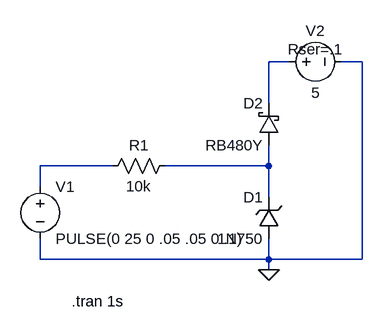
[diagram p0: schematic input_power_sim.asc]
input_power_sim.asc, the LTspice schematic file:
Version 4
SHEET 1 880 680
WIRE 304 -32 272 -32
WIRE 416 -32 384 -32
WIRE 272 32 272 -32
WIRE 32 128 -80 128
WIRE 272 128 272 96
WIRE 272 128 112 128
WIRE -80 160 -80 128
WIRE 272 176 272 128
WIRE -80 272 -80 240
WIRE 272 272 272 240
WIRE 272 272 -80 272
WIRE 416 272 416 -32
WIRE 416 272 272 272
WIRE 272 288 272 272
FLAG 272 288 0
SYMBOL zener 288 240 R180
WINDOW 0 24 64 Left 2
WINDOW 3 24 0 Left 2
SYMATTR InstName D1
SYMATTR Value 1N750
SYMBOL schottky 288 96 R180
WINDOW 0 24 64 Left 2
WINDOW 3 24 0 Left 2
SYMATTR InstName D2
SYMATTR Value RB480Y
SYMBOL res 128 112 R90
WINDOW 0 0 56 VBottom 2
WINDOW 3 32 56 VTop 2
SYMATTR InstName R1
SYMATTR Value 10k
SYMBOL voltage -80 144 R0
WINDOW 123 0 0 Left 2
WINDOW 39 0 0 Left 2
SYMATTR InstName V1
SYMATTR Value PULSE(0 25 0 .05 .05 0 .1)
SYMBOL voltage 288 -32 R270
WINDOW 0 32 56 VTop 2
WINDOW 3 -32 56 VBottom 2
WINDOW 123 0 0 Left 2
WINDOW 39 4 56 VTop 2
SYMATTR InstName V2
SYMATTR Value 5
SYMATTR SpiceLine Rser=.1
TEXT -32 336 Left 2 !.tran 1s

The netlist it stands for:
* input_power_sim.asc
D1 0 N003 1N750
D2 N003 N001 RB480Y
R1 N003 N002 10k
V1 N002 0 PULSE(0 25 0 .05 .05 0 .1)
V2 N001 0 5 Rser=.1
.model D D
.lib standard.dio
.tran 1s
.backanno
.end